# Altium schematic sheet DDR3.SchDoc
size A4; SheetNumber: 3; SheetTotal: 9
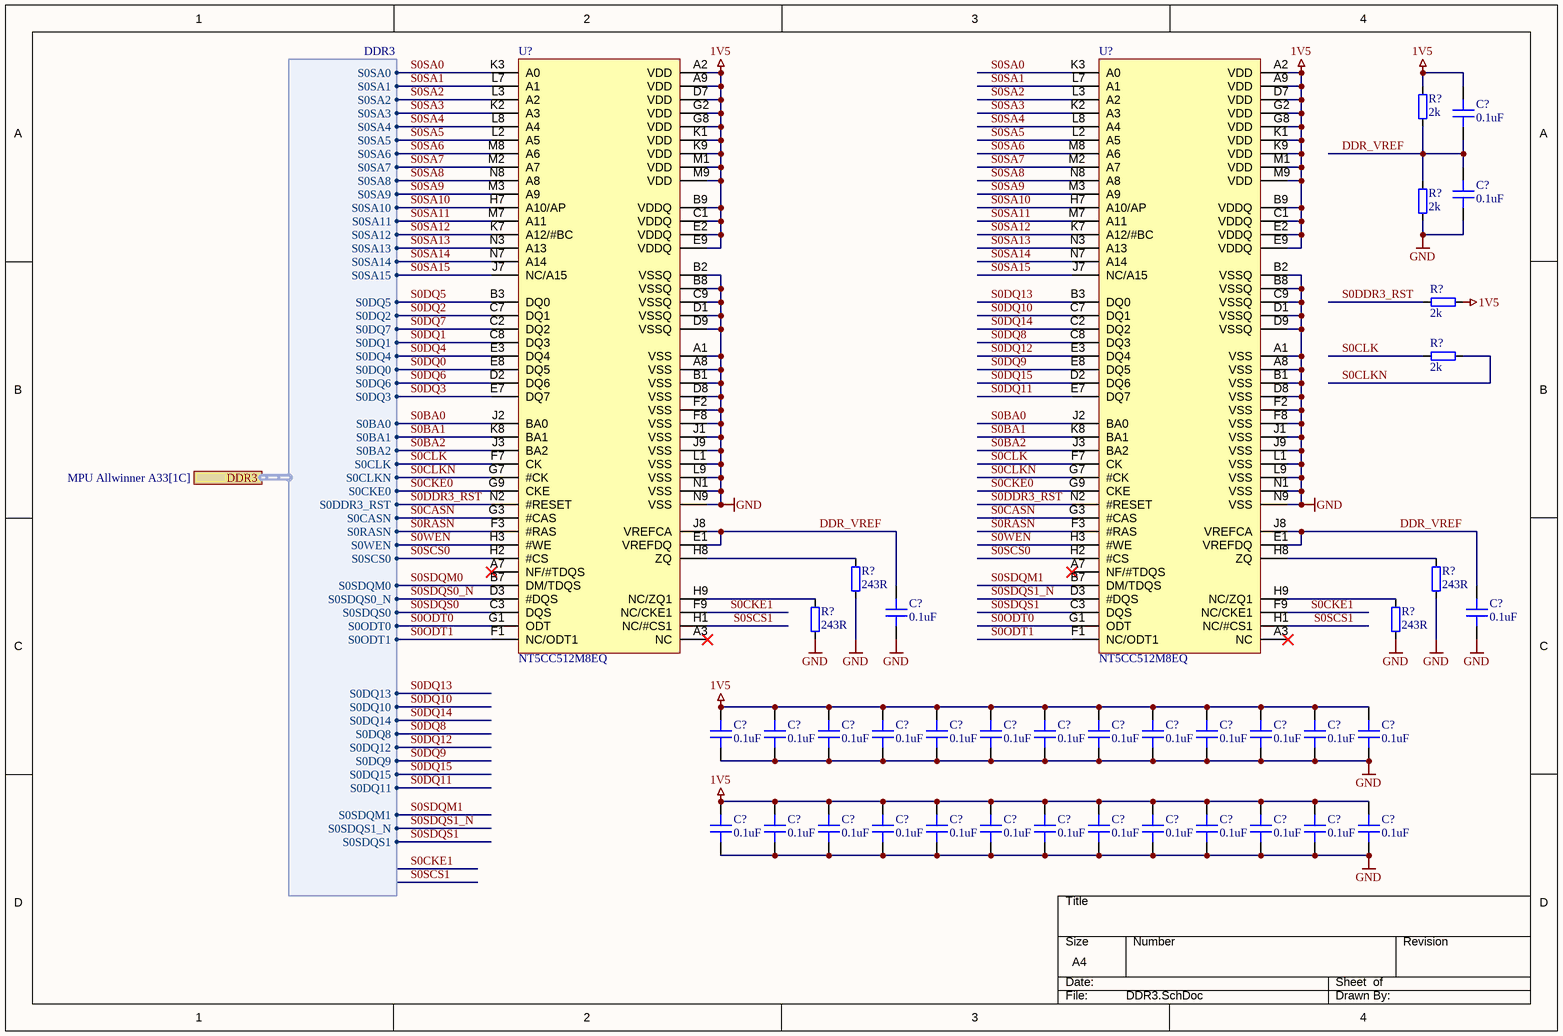
[diagram p0: DDR3.SchDoc]

## Parts
(Parts that share a designator on the sheet are numbered #1, #2 ... from top to bottom, then left to right.)
C?#1  0.1uF  [CAPC1005X06N]
C?#2  0.1uF  [CAPC1005X06N]
C?#3  0.1uF  [CAPC1005X06N]
C?#4  0.1uF  [CAPC1005X06N]
C?#5  0.1uF  [CAPC1005X06N]
C?#6  0.1uF  [CAPC1005X06N]
C?#7  0.1uF  [CAPC1005X06N]
C?#8  0.1uF  [CAPC1005X06N]
C?#9  0.1uF  [CAPC1005X06N]
C?#10  0.1uF  [CAPC1005X06N]
C?#11  0.1uF  [CAPC1005X06N]
C?#12  0.1uF  [CAPC1005X06N]
C?#13  0.1uF  [CAPC1005X06N]
C?#14  0.1uF  [CAPC1005X06N]
C?#15  0.1uF  [CAPC1005X06N]
C?#16  0.1uF  [CAPC1005X06N]
C?#17  0.1uF  [CAPC1005X06N]
C?#18  0.1uF  [CAPC1005X06N]
C?#19  0.1uF  [CAPC1005X06N]
C?#20  0.1uF  [CAPC1005X06N]
C?#21  0.1uF  [CAPC1005X06N]
C?#22  0.1uF  [CAPC1005X06N]
C?#23  0.1uF  [CAPC1005X06N]
C?#24  0.1uF  [CAPC1005X06N]
C?#25  0.1uF  [CAPC1005X06N]
C?#26  0.1uF  [CAPC1005X06N]
C?#27  0.1uF  [CAPC1005X06N]
C?#28  0.1uF  [CAPC1005X06N]
C?#29  0.1uF  [CAPC1005X06N]
C?#30  0.1uF  [CAPC1005X06N]
R?#1  2k  [RESC1005X35N]
R?#2  2k  [RESC1005X35N]
R?#3  2k  [RESC1005X35N]
R?#4  2k  [RESC1005X35N]
R?#5  243R  [RESC1005X35N]
R?#6  243R  [RESC1005X35N]
R?#7  243R  [RESC1005X35N]
R?#8  243R  [RESC1005X35N]
U?#1  NT5CC512M8EQ  [BGA78C80P9X13_800X1050X120]
U?#2  NT5CC512M8EQ  [BGA78C80P9X13_800X1050X120]

## Ports
DDR3 (harness DDR3, see MPU Allwinner A33[1C])

## Harnesses
DDR3: S0SA0, S0SA1, S0SA2, S0SA3, S0SA4, S0SA5, S0SA6, S0SA7, S0SA8, S0SA9, S0SA10, S0SA11, S0SA12, S0SA13, S0SA14, S0SA15, S0DQ5, S0DQ2, S0DQ7, S0DQ1, S0DQ4, S0DQ0, S0DQ6, S0DQ3, S0BA0, S0BA1, S0BA2, S0CLK, S0CLKN, S0CKE0, S0DDR3_RST, S0CASN, S0RASN, S0WEN, S0SCS0, S0SDQM0, S0SDQS0_N, S0SDQS0, S0ODT0, S0ODT1, S0DQ13, S0DQ10, S0DQ14, S0DQ8, S0DQ12, S0DQ9, S0DQ15, S0DQ11, S0SDQM1, S0SDQS1_N, S0SDQS1

## Nets
1V5: C?#1.1 C?#5.1 C?#6.1 C?#7.1 C?#8.1 C?#9.1 C?#10.1 C?#11.1 C?#12.1 C?#13.1 C?#14.1 C?#15.1 C?#16.1 C?#17.1 C?#18.1 C?#19.1 C?#20.1 C?#21.1 C?#22.1 C?#23.1 C?#24.1 C?#25.1 C?#26.1 C?#27.1 C?#28.1 C?#29.1 C?#30.1 R?#1.1 R?#3.2 U?#1.A2(VDD) U?#1.A9(VDD) U?#1.B9(VDDQ) U?#1.C1(VDDQ) U?#1.D7(VDD) U?#1.E2(VDDQ) U?#1.E9(VDDQ) U?#1.G2(VDD) U?#1.G8(VDD) U?#1.K1(VDD) U?#1.K9(VDD) U?#1.M1(VDD) U?#1.M9(VDD) U?#2.A2(VDD) U?#2.A9(VDD) U?#2.B9(VDDQ) U?#2.C1(VDDQ) U?#2.D7(VDD) U?#2.E2(VDDQ) U?#2.E9(VDDQ) U?#2.G2(VDD) U?#2.G8(VDD) U?#2.K1(VDD) U?#2.K9(VDD) U?#2.M1(VDD) U?#2.M9(VDD)
GND: C?#2.2 C?#3.2 C?#4.2 C?#5.2 C?#6.2 C?#7.2 C?#8.2 C?#9.2 C?#10.2 C?#11.2 C?#12.2 C?#13.2 C?#14.2 C?#15.2 C?#16.2 C?#17.2 C?#18.2 C?#19.2 C?#20.2 C?#21.2 C?#22.2 C?#23.2 C?#24.2 C?#25.2 C?#26.2 C?#27.2 C?#28.2 C?#29.2 C?#30.2 R?#2.2 R?#5.1 R?#6.1 R?#7.1 R?#8.1 U?#1.A1(VSS) U?#1.A8(VSS) U?#1.B1(VSS) U?#1.B2(VSSQ) U?#1.B8(VSSQ) U?#1.C9(VSSQ) U?#1.D1(VSSQ) U?#1.D8(VSS) U?#1.D9(VSSQ) U?#1.F2(VSS) U?#1.F8(VSS) U?#1.J1(VSS) U?#1.J9(VSS) U?#1.L1(VSS) U?#1.L9(VSS) U?#1.N1(VSS) U?#1.N9(VSS) U?#2.A1(VSS) U?#2.A8(VSS) U?#2.B1(VSS) U?#2.B2(VSSQ) U?#2.B8(VSSQ) U?#2.C9(VSSQ) U?#2.D1(VSSQ) U?#2.D8(VSS) U?#2.D9(VSSQ) U?#2.F2(VSS) U?#2.F8(VSS) U?#2.J1(VSS) U?#2.J9(VSS) U?#2.L1(VSS) U?#2.L9(VSS) U?#2.N1(VSS) U?#2.N9(VSS)
DDR_VREF: C?#1.2 C?#2.1 C?#3.1 C?#4.1 R?#1.2 R?#2.1 U?#1.E1(VREFDQ) U?#1.J8(VREFCA) U?#2.E1(VREFDQ) U?#2.J8(VREFCA)
S0BA0: U?#1.J2(BA0) U?#2.J2(BA0) ; port DDR3.S0BA0
S0BA1: U?#1.K8(BA1) U?#2.K8(BA1) ; port DDR3.S0BA1
S0BA2: U?#1.J3(BA2) U?#2.J3(BA2) ; port DDR3.S0BA2
S0CASN: U?#1.G3(#CAS) U?#2.G3(#CAS) ; port DDR3.S0CASN
S0CKE0: U?#1.G9(CKE) U?#2.G9(CKE) ; port DDR3.S0CKE0
S0CKE1: U?#1.F9(NC/CKE1) U?#2.F9(NC/CKE1)
S0CLK: R?#4.1 U?#1.F7(CK) U?#2.F7(CK) ; port DDR3.S0CLK
S0CLKN: R?#4.2 U?#1.G7(#CK) U?#2.G7(#CK) ; port DDR3.S0CLKN
S0DDR3_RST: R?#3.1 U?#1.N2(#RESET) U?#2.N2(#RESET) ; port DDR3.S0DDR3_RST
S0DQ0: U?#1.E8(DQ5) ; port DDR3.S0DQ0
S0DQ1: U?#1.C8(DQ3) ; port DDR3.S0DQ1
S0DQ2: U?#1.C7(DQ1) ; port DDR3.S0DQ2
S0DQ3: U?#1.E7(DQ7) ; port DDR3.S0DQ3
S0DQ4: U?#1.E3(DQ4) ; port DDR3.S0DQ4
S0DQ5: U?#1.B3(DQ0) ; port DDR3.S0DQ5
S0DQ6: U?#1.D2(DQ6) ; port DDR3.S0DQ6
S0DQ7: U?#1.C2(DQ2) ; port DDR3.S0DQ7
S0DQ8: U?#2.C8(DQ3) ; port DDR3.S0DQ8
S0DQ9: U?#2.E8(DQ5) ; port DDR3.S0DQ9
S0DQ10: U?#2.C7(DQ1) ; port DDR3.S0DQ10
S0DQ11: U?#2.E7(DQ7) ; port DDR3.S0DQ11
S0DQ12: U?#2.E3(DQ4) ; port DDR3.S0DQ12
S0DQ13: U?#2.B3(DQ0) ; port DDR3.S0DQ13
S0DQ14: U?#2.C2(DQ2) ; port DDR3.S0DQ14
S0DQ15: U?#2.D2(DQ6) ; port DDR3.S0DQ15
S0ODT0: U?#1.G1(ODT) U?#2.G1(ODT) ; port DDR3.S0ODT0
S0ODT1: U?#1.F1(NC/ODT1) U?#2.F1(NC/ODT1) ; port DDR3.S0ODT1
S0RASN: U?#1.F3(#RAS) U?#2.F3(#RAS) ; port DDR3.S0RASN
S0SA0: U?#1.K3(A0) U?#2.K3(A0) ; port DDR3.S0SA0
S0SA1: U?#1.L7(A1) U?#2.L7(A1) ; port DDR3.S0SA1
S0SA2: U?#1.L3(A2) U?#2.L3(A2) ; port DDR3.S0SA2
S0SA3: U?#1.K2(A3) U?#2.K2(A3) ; port DDR3.S0SA3
S0SA4: U?#1.L8(A4) U?#2.L8(A4) ; port DDR3.S0SA4
S0SA5: U?#1.L2(A5) U?#2.L2(A5) ; port DDR3.S0SA5
S0SA6: U?#1.M8(A6) U?#2.M8(A6) ; port DDR3.S0SA6
S0SA7: U?#1.M2(A7) U?#2.M2(A7) ; port DDR3.S0SA7
S0SA8: U?#1.N8(A8) U?#2.N8(A8) ; port DDR3.S0SA8
S0SA9: U?#1.M3(A9) U?#2.M3(A9) ; port DDR3.S0SA9
S0SA10: U?#1.H7(A10/AP) U?#2.H7(A10/AP) ; port DDR3.S0SA10
S0SA11: U?#1.M7(A11) U?#2.M7(A11) ; port DDR3.S0SA11
S0SA12: U?#1.K7(A12/#BC) U?#2.K7(A12/#BC) ; port DDR3.S0SA12
S0SA13: U?#1.N3(A13) U?#2.N3(A13) ; port DDR3.S0SA13
S0SA14: U?#1.N7(A14) U?#2.N7(A14) ; port DDR3.S0SA14
S0SA15: U?#1.J7(NC/A15) U?#2.J7(NC/A15) ; port DDR3.S0SA15
S0SCS0: U?#1.H2(#CS) U?#2.H2(#CS) ; port DDR3.S0SCS0
S0SCS1: U?#1.H1(NC/#CS1) U?#2.H1(NC/#CS1)
S0SDQM0: U?#1.B7(DM/TDQS) ; port DDR3.S0SDQM0
S0SDQM1: U?#2.B7(DM/TDQS) ; port DDR3.S0SDQM1
S0SDQS0: U?#1.C3(DQS) ; port DDR3.S0SDQS0
S0SDQS0_N: U?#1.D3(#DQS) ; port DDR3.S0SDQS0_N
S0SDQS1: U?#2.C3(DQS) ; port DDR3.S0SDQS1
S0SDQS1_N: U?#2.D3(#DQS) ; port DDR3.S0SDQS1_N
S0WEN: U?#1.H3(#WE) U?#2.H3(#WE) ; port DDR3.S0WEN
NetR?#5_2: R?#5.2 U?#1.H8(ZQ)
NetR?#6_2: R?#6.2 U?#2.H8(ZQ)
NetR?#7_2: R?#7.2 U?#1.H9(NC/ZQ1)
NetR?#8_2: R?#8.2 U?#2.H9(NC/ZQ1)

Not connected (* = marked no-connect by the designer): U?#1 A3(NC)* A7(NF/#TDQS)*; U?#2 A3(NC)* A7(NF/#TDQS)*

## Notes on the sheet
- THIS DOCUMENT AND THE DATA DISCLOSED HEREIN OR
- HEREWITH IS THE PROPERTY OF ALTIUM LIMITED AND MAY
- DWG NO:
- REVISION
- REV:
- DESCRIPTION
- DATE
- APPROVED
- BE FREELY DISTRIBUTED IN WHOLE. NO RIGHTS ARE
- RESERVED OR EXPRESS OR IMPLIED WARANTEE GIVEN.
- ENG:
- APPROVALS
- PROJECT
- DSN:
- CHK:
- REFERENCE DOCUMENTS
- PROJECT REVISION:
- TITLE
- DOCUMENT REVISION:
- DESIGN ITEM:
- BOM:
- FAB DWG:
- PCB DWG:
- ASSY DWG:
- SCALE:
- A3
- SIZE
- CAGE CODE
- FILE NAME
- DWG NO.
- SHEET
- OF
- REV

## Library data of the parts
C?#1-C?#30 = 0402B104K500CT: Manufacturer: Walsin Tech Corp; Voltage: 50V; Tolerance: 10%; Dielectric: X7R; Min Temperature: -55; Max Temperature: 125; Part Number: 0402B104K500CT; ComponentLink1URL: https://datasheet.lcsc.com/lcsc/1810191621_Walsin-Tech-Corp-0402B104K500CT_C152814.pdf; ComponentLink1Description: Datasheet; Package: 0402; Part Status: Active; Capacitance: 0.1uF
R?#1-R?#4 = WR04X2001FTL: Resistor; Manufacturer: Walsin Tech Corp; Tolerance: 1%; Power: 1/16 W; Temperature Coefficient: 100ppm; Min Temperature: -55°C; Max Temperature: 155°C; Part Number: WR04X2001FTL; ComponentLink1URL: https://datasheet.lcsc.com/lcsc/1810191630_Walsin-Tech-Corp-WR04X2001FTL_C163822.pdf; ComponentLink1Description: Datasheet; Package: 0402; Part Status: Active; Resistance: 2k
R?#5-R?#8 = FRC0402F2430TS: Resistor; Manufacturer: FOJAN; Tolerance: 1%; Power: 1/16 W; Temperature Coefficient: 100ppm; Min Temperature: -55°C; Max Temperature: 155°C; Part Number: FRC0402F2430TS; ComponentLink1URL: https://datasheet.lcsc.com/lcsc/2201121430_FOJAN-FRC0402F2430TS_C2929995.pdf; ComponentLink1Description: Datasheet; Package: 0402; Part Status: Active; Resistance: 243R
U?#1 U?#2 = NT5CC512M8EQ: DDR3-1600, TFBGA-78; MANUFACTURER: Nanya Technology Cooperation; Part Number: NT5CC512M8EQ; COMPONENTLINK1URL: https://datasheet.lcsc.com/szlcsc/1912111437_Nanya-Tech-NT5CC256M16ER-EK_C428584.pdf; COMPONENTLINK1DESCRIPTION: Datasheet; PACKAGE: FBGA-78; Part Status: Active